# Altium schematic sheet BMS AFE - Top Sheet.SchDoc: Title
size B; Organization: Midnight Sun Solar Rayce Car Team; Address1: University of Waterloo; Address2: 200 University Ave W; Address3: Waterloo, ON, Canada; Address4: N2L 3E9; DocumentNumber: 1; SheetNumber: 1; SheetTotal: 8; Website: www.uwmidsun.com; ProjectName: ProjectName
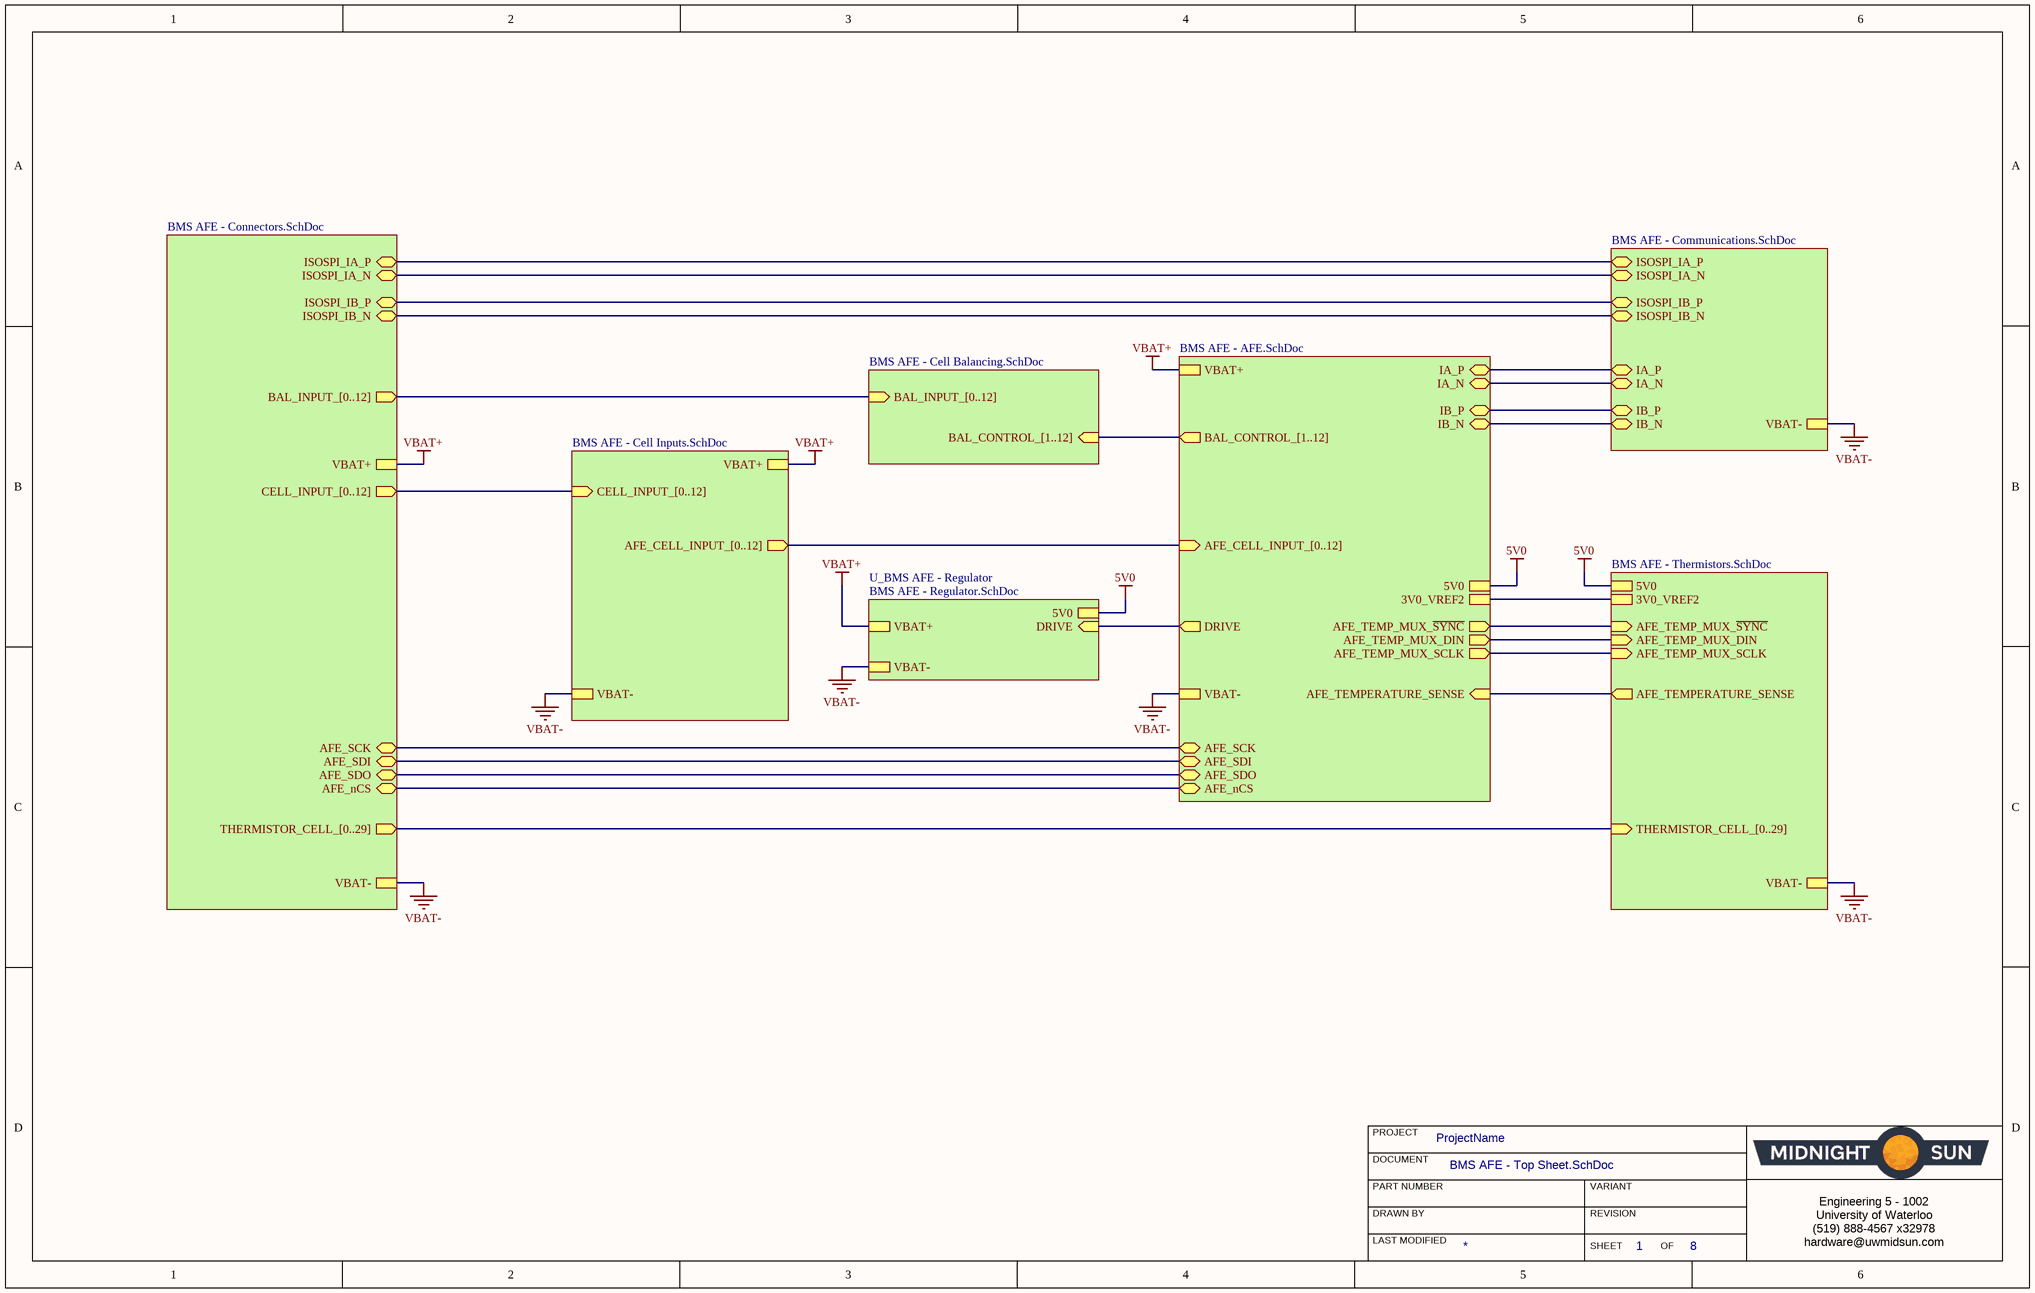
[diagram p0: BMS AFE - Top Sheet.SchDoc]

## Sub-sheets
BMS AFE - AFE = BMS AFE - AFE.SchDoc: BAL_CONTROL_[1..12] (out), AFE_TEMP_MUX_~{SYNC} (out), AFE_nCS (bidir), AFE_SCK (bidir), AFE_TEMP_MUX_SCLK (out), 5V0, VBAT-, 3V0_VREF2, AFE_CELL_INPUT_[0..12] (in), AFE_TEMPERATURE_SENSE (in), AFE_TEMP_MUX_DIN (out), VBAT+, AFE_SDI (bidir), AFE_SDO (bidir), IA_N (bidir), IA_P (bidir), IB_N (bidir), IB_P (bidir), DRIVE (out)
BMS AFE - Cell Balancing = BMS AFE - Cell Balancing.SchDoc: BAL_CONTROL_[1..12] (in), BAL_INPUT_[0..12] (in)
BMS AFE - Cell Inputs = BMS AFE - Cell Inputs.SchDoc: VBAT+, CELL_INPUT_[0..12] (in), AFE_CELL_INPUT_[0..12] (out), VBAT-
BMS AFE - Communications = BMS AFE - Communications.SchDoc: IB_P (bidir), IB_N (bidir), ISOSPI_IA_P (bidir), ISOSPI_IA_N (bidir), IA_P (bidir), ISOSPI_IB_P (bidir), IA_N (bidir), ISOSPI_IB_N (bidir), VBAT-
BMS AFE - Connectors = BMS AFE - Connectors.SchDoc: ISOSPI_IB_N (bidir), ISOSPI_IB_P (bidir), ISOSPI_IA_N (bidir), ISOSPI_IA_P (bidir), VBAT+, AFE_nCS (bidir), AFE_SCK (bidir), CELL_INPUT_[0..12] (out), THERMISTOR_CELL_[0..29] (out), AFE_SDI (bidir), AFE_SDO (bidir), VBAT-, BAL_INPUT_[0..12] (out)
BMS AFE - Thermistors = BMS AFE - Thermistors.SchDoc: AFE_TEMPERATURE_SENSE (out), 5V0, 3V0_VREF2, AFE_TEMP_MUX_SCLK (in), AFE_TEMP_MUX_DIN (in), AFE_TEMP_MUX_~{SYNC} (in), THERMISTOR_CELL_[0..29] (in), VBAT-
U_BMS AFE - Regulator = BMS AFE - Regulator.SchDoc: DRIVE (in), VBAT+, 5V0, VBAT-

## Nets
5V0: sheet BMS AFE - AFE/5V0, sheet BMS AFE - Thermistors/5V0, sheet U_BMS AFE - Regulator/5V0
VBAT+: sheet BMS AFE - AFE/VBAT+, sheet BMS AFE - Cell Inputs/VBAT+, sheet BMS AFE - Connectors/VBAT+, sheet U_BMS AFE - Regulator/VBAT+
VBAT-: sheet BMS AFE - AFE/VBAT-, sheet BMS AFE - Cell Inputs/VBAT-, sheet BMS AFE - Communications/VBAT-, sheet BMS AFE - Thermistors/VBAT-, sheet BMS AFE - Connectors/VBAT-, sheet U_BMS AFE - Regulator/VBAT-
(unnamed): sheet BMS AFE - AFE/AFE_TEMP_MUX_~{SYNC}, sheet BMS AFE - Thermistors/AFE_TEMP_MUX_~{SYNC}
(unnamed): sheet BMS AFE - AFE/AFE_nCS, sheet BMS AFE - Connectors/AFE_nCS
(unnamed): sheet BMS AFE - AFE/AFE_SCK, sheet BMS AFE - Connectors/AFE_SCK
(unnamed): sheet BMS AFE - AFE/AFE_TEMP_MUX_SCLK, sheet BMS AFE - Thermistors/AFE_TEMP_MUX_SCLK
(unnamed): sheet BMS AFE - AFE/3V0_VREF2, sheet BMS AFE - Thermistors/3V0_VREF2
(unnamed): sheet BMS AFE - AFE/AFE_TEMPERATURE_SENSE, sheet BMS AFE - Thermistors/AFE_TEMPERATURE_SENSE
(unnamed): sheet BMS AFE - AFE/AFE_TEMP_MUX_DIN, sheet BMS AFE - Thermistors/AFE_TEMP_MUX_DIN
(unnamed): sheet BMS AFE - AFE/AFE_SDI, sheet BMS AFE - Connectors/AFE_SDI
(unnamed): sheet BMS AFE - AFE/AFE_SDO, sheet BMS AFE - Connectors/AFE_SDO
(unnamed): sheet BMS AFE - AFE/IA_N, sheet BMS AFE - Communications/IA_N
(unnamed): sheet BMS AFE - AFE/IA_P, sheet BMS AFE - Communications/IA_P
(unnamed): sheet BMS AFE - AFE/IB_N, sheet BMS AFE - Communications/IB_N
(unnamed): sheet BMS AFE - AFE/IB_P, sheet BMS AFE - Communications/IB_P
(unnamed): sheet BMS AFE - AFE/DRIVE, sheet U_BMS AFE - Regulator/DRIVE
(unnamed): sheet BMS AFE - Communications/ISOSPI_IA_P, sheet BMS AFE - Connectors/ISOSPI_IA_P
(unnamed): sheet BMS AFE - Communications/ISOSPI_IA_N, sheet BMS AFE - Connectors/ISOSPI_IA_N
(unnamed): sheet BMS AFE - Communications/ISOSPI_IB_P, sheet BMS AFE - Connectors/ISOSPI_IB_P
(unnamed): sheet BMS AFE - Communications/ISOSPI_IB_N, sheet BMS AFE - Connectors/ISOSPI_IB_N

## Buses and harness runs
bus sheet BMS AFE - AFE/AFE_CELL_INPUT_[0..12] = sheet BMS AFE - Cell Inputs/AFE_CELL_INPUT_[0..12]
bus sheet BMS AFE - AFE/BAL_CONTROL_[1..12] = sheet BMS AFE - Cell Balancing/BAL_CONTROL_[1..12]
bus sheet BMS AFE - Cell Balancing/BAL_INPUT_[0..12] = sheet BMS AFE - Connectors/BAL_INPUT_[0..12]
bus sheet BMS AFE - Cell Inputs/CELL_INPUT_[0..12] = sheet BMS AFE - Connectors/CELL_INPUT_[0..12]
bus sheet BMS AFE - Connectors/THERMISTOR_CELL_[0..29] = sheet BMS AFE - Thermistors/THERMISTOR_CELL_[0..29]

## Notes on the sheet
- PROJECT
- DOCUMENT
- DRAWN BY
- LAST MODIFIED
- PART NUMBER
- REVISION
- SHEET
- VARIANT
- OF
- Engineering 5 - 1002
  University of Waterloo
  (519) 888-4567 x32978
  hardware@uwmidsun.com